# Altium schematic sheet RTC.SchDoc: Evaluation Board 3.2
size A3; Organization: Toradex AG; Address1: Altsagenstrasse 5; Address2: Horw; Address3: 6048; Address4: Switzerland; DocumentNumber: 5; Revision: V3.2; SheetNumber: 5; SheetTotal: 23; PageSetup: Record=PageOptions|CenterHorizontal=True|CenterVertical=True|PrintScale=0.73|XCorrection=1.00|YCorrection=1.00|PrintKind=0|BorderSize=5000000|LeftOffset=0|BottomOffset=0|Orientation=2|PaperLength=1000|PaperWidth=1000|Scale=100|PaperSource=7|PrintQuality=-4|MediaType=1|DitherType=10|PaperKind=A4|PrintScaleMode=1
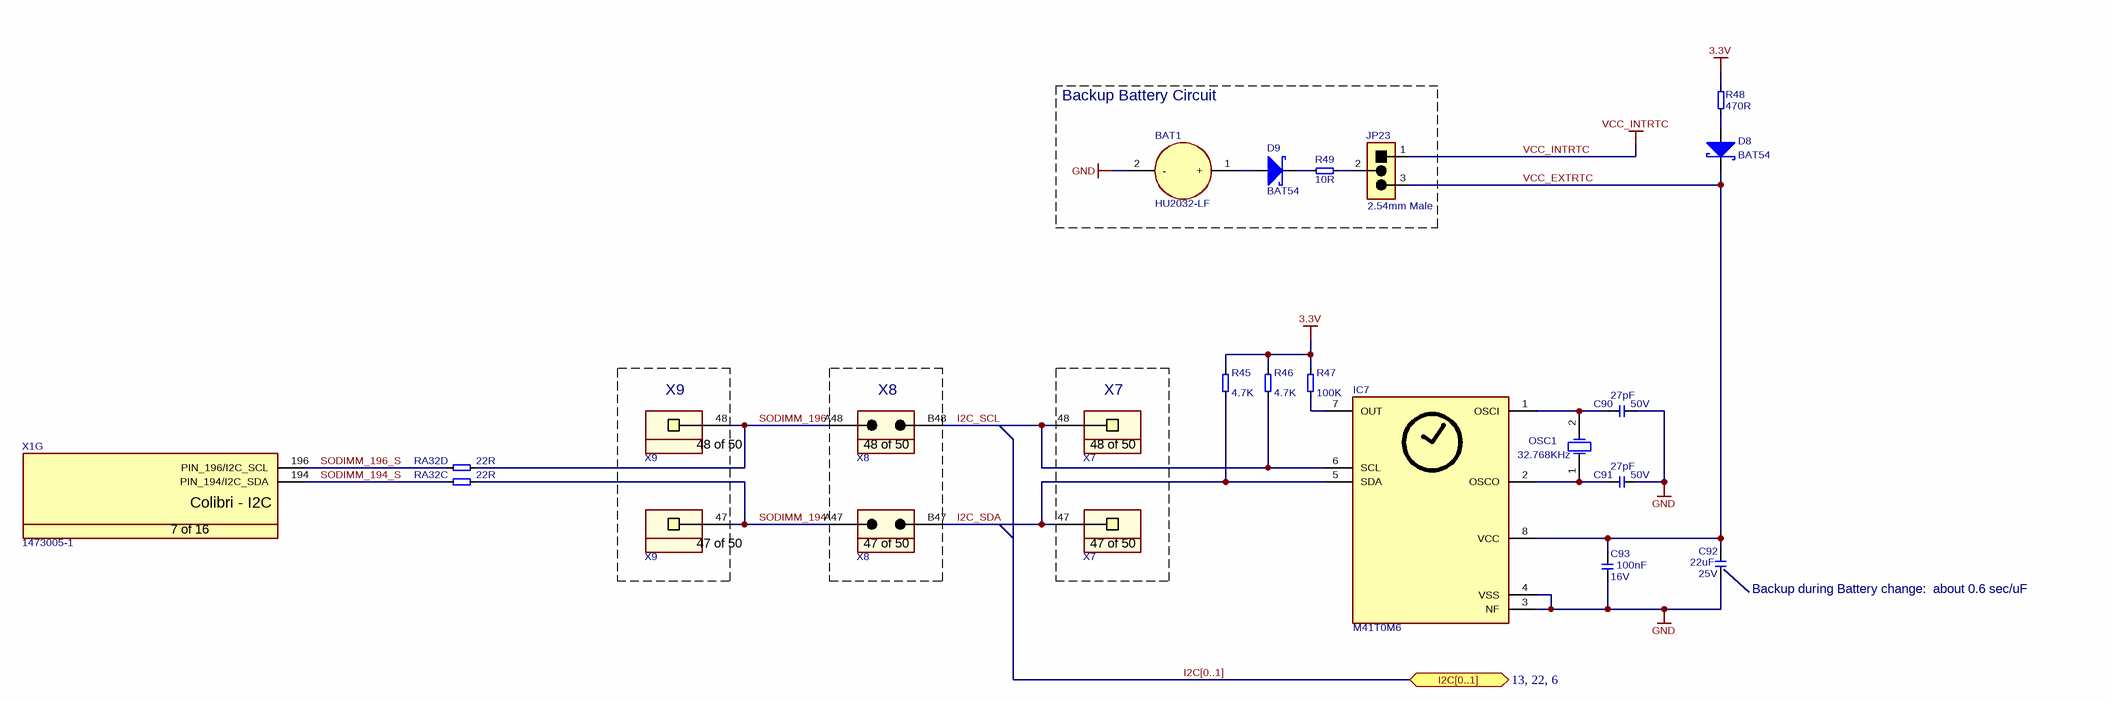
[diagram p0: RTC.SchDoc]

## Parts
BAT1  HU2032-LF  [T_Renata_HU2032-LF]
C90  Rating: 50V  [T_CAPC0603X33N]  (hidden comment: 27pF)
C91  Rating: 50V  [T_CAPC0603X33N]  (hidden comment: 27pF)
C92  Rating: 25V  [CAPC3225X160N]  (hidden comment: 22uF)
C93  Rating: 16V  [T_CAPC0603X33N]  (hidden comment: 100nF)
D8  BAT54  [SOT95P230X110-3N]
D9  BAT54  [SOT95P230X110-3N]
IC7  M41T0M6  [SOIC127P600X173-8N]
JP23  826936-3  [T_TYCO_826936-3]  (value not drawn)
OSC1  value 32.768KHz  [T_MC_CC4V-T1A]  (hidden comment: CC4V-T1A)
R45  4.7K  [t_RESC0603X30N]
R46  4.7K  [t_RESC0603X30N]
R47  100K  [t_RESC0603X30N]
R48  470R  [T_RESC0603X30N]
R49  10R  [t_RESC0603X30N]
RA32  22R  [T_Resistor_Array_X4]  (parts C,D of 4)
X1  Manufacturer Part No.: 1473005-1  [T_Tyco_1473005-1]  (hidden comment: CON-Tyco-1473005-1-200-0.6mm)  (part G of 16)
X7  SSW-110-01-G-S  [T_Samtec_SSW-110-01-G-S]  (value not drawn)  (parts 47,48 of 50)
X8  TSW-110-07-G-D  [T_Samtec_TSW-110-07-G-D]  (value not drawn)  (parts 47,48 of 50)
X9  SSW-110-01-G-S  [T_Samtec_SSW-110-01-G-S]  (value not drawn)  (parts 47,48 of 50)

## Blocks framed on the sheet
Backup Battery Circuit: BAT1 D9 JP23 R49
X9: X9
X8: X8
X7: X7

## Ports
I2C[0..1] (bidir, see 13, 22, 6)

## Nets
3.3V: R45.2 R46.2 R47.2 R48.2
GND: BAT1.2(-) C90.2 C91.2 C92.1 C93.1 IC7.3(NF) IC7.4(VSS)
VCC_INTRTC: JP23.1
I2C_SCL: IC7.6(SCL) R46.1 X7.48 X8.B48
I2C_SDA: IC7.5(SDA) R45.1 X7.47 X8.B47
SODIMM_194: RA32.7 X8.A47 X9.47
SODIMM_194_S: RA32.3 X1.194(PIN_194/I2C_SDA)
SODIMM_196: RA32.8 X8.A48 X9.48
SODIMM_196_S: RA32.4 X1.196(PIN_196/I2C_SCL)
VCC_EXTRTC: C92.2 C93.2 D8.3 IC7.8(VCC) JP23.3
NetBAT1_1: BAT1.1(+) D9.1
NetC90_1: C90.1 IC7.1(OSCI) OSC1.2(OSC2)
NetC91_1: C91.1 IC7.2(OSCO) OSC1.1(OSC1)
NetD8_1: D8.1 R48.1
NetD9_3: D9.3 R49.1
NetIC7_7: IC7.7(OUT) R47.1
NetJP23_2: JP23.2 R49.2

## Buses and harness runs
bus I2C[0..1] = port I2C[0..1]

## Notes on the sheet
- (near JP23) 2.54mm Male
- (near C92) Backup during Battery change:  about 0.6 sec/uF
- Title
- Size:
- Date:
- A3
- Number:
- Time:
- Revision:
- Sheet
- of
- File:
- (in symbol CON-Samtec-SSW-110-01-G-S, part 47) 47 of 50
- (in symbol CON-Samtec-SSW-110-01-G-S, part 48) 48 of 50
- (in symbol CON-Samtec-TSW-110-07-G-D, part 47) 47 of 50
- (in symbol CON-Samtec-TSW-110-07-G-D, part 48) 48 of 50
- (in symbol CON-Tyco-1473005-1-200-0.6mm, part G) Colibri - I2C; 7 of 16

## Library data of the parts
BAT1 = BAT-Renata-HU2032-LF: C2032 Battery Holder; Manufacturer Name: Renata; Manufacturer Part No.: HU2032-LF
C90 C91 = C-NPO-27pF-50V-5%-0603: Capacitor Ceramic NPO 27pF 50V 5% 0603; Tolerance: 5%; Type: NPO; Value: 27pF
C92 = C-X5R-22uF-25V-20%-1210: Capacitor Ceramic X5R 22uF 25V 20% 1210; Tolerance: 20%; Type: X5R; Value: 22uF
C93 = C-X7R-100nF-16V-10%-0603: Capacitor Ceramic X7R 100nF 16V 10% 0603; Tolerance: 10%; Type: X7R; Value: 100nF
D8 D9 = D-Philips-BAT54-Schottky: BAT54 Schottky Diode; Manufacturer Name: Philips; Manufacturer Part No.: BAT54
IC7 = IC-ST-M41T0M6: RTC M41T0M6; Manufacturer Name: ST; Manufacturer Part No.: M41T0M6
JP23 = CON-Tyco-826936-3-1X3-2.54mm-JP_1: Jumper, 3-Pin; Manufacturer Name: Tyco; No. of ways: 1X3; Pitch: 2.54mm; Manufacturer Part No.: 826936-3
OSC1 = OSC-MC-CC4V-T1A-32.768KHz-30ppm-5x1.9mm: Quartz 32.768kHz; Manufacturer Name: Micro Crystal; Tolerance: 30ppm; Manufacturer Part No.: CC4V-T1A
R45 R46 = R-4.7kR-63mW-5%-0603: Resistor 4.7 Kohm 63mW 5% 0603; Value: 4.7KR; Rating: 63mW; Tolerance: 5%
R47 = R-100KR-63mW-5%-0603: Resistor 100 Kohm 63mW 5% 0603; Value: 100KR; Rating: 63mW; Tolerance: 5%
R48 = R-470R-63mW-5%-0603: Resistor 470 ohm 63mW 5% 0603; Rating: 63mW; Tolerance: 5%; Value: 470R
R49 = R-10R-63mW-5%-0603: Resistor 10 ohm 63mW 5% 0603; Rating: 63mW; Tolerance: 5%; Value: 10R
RA32 = RA-22R-63mW-5%-1206-div: Resistor Array 22 R 63mW 5% 1206; Tolerance: 5%; Power Dissipation: 63mW; Value: 22R
X1 = CON-Tyco-1473005-1-200-0.6mm: SODIMM Connector; Manufacturer Name: Tyco; No. of ways: 200
X7 X9 = CON-Samtec-SSW-110-01-G-S: Header 1x50 pin 2.54mm pitch; Manufacturer Name: Samtec; Pitch: 2.54mm; No. of ways: 1x50; Manufacturer Part No.: SSW-110-01-G-S
X8 = CON-Samtec-TSW-110-07-G-D: Header 2x50 pin 2.54mm pitch; Manufacturer Name: Samtec; Pitch: 2.54mm; No. of ways: 2x50; Manufacturer Part No.: TSW-110-07-G-D